# Altium schematic sheet Hrafn_Top.SchDoc: Hrafn
size Tabloid; DrawnBy: Nicholas Belsten; Organization: MIT; Address1: Route 40; Address2: Westford MA 01886; Address3: USA; DocumentNumber: 1; SheetNumber: 2; SheetTotal: 10; DCN: Aika; ProgramName: AERO-VISTA; Section: Top
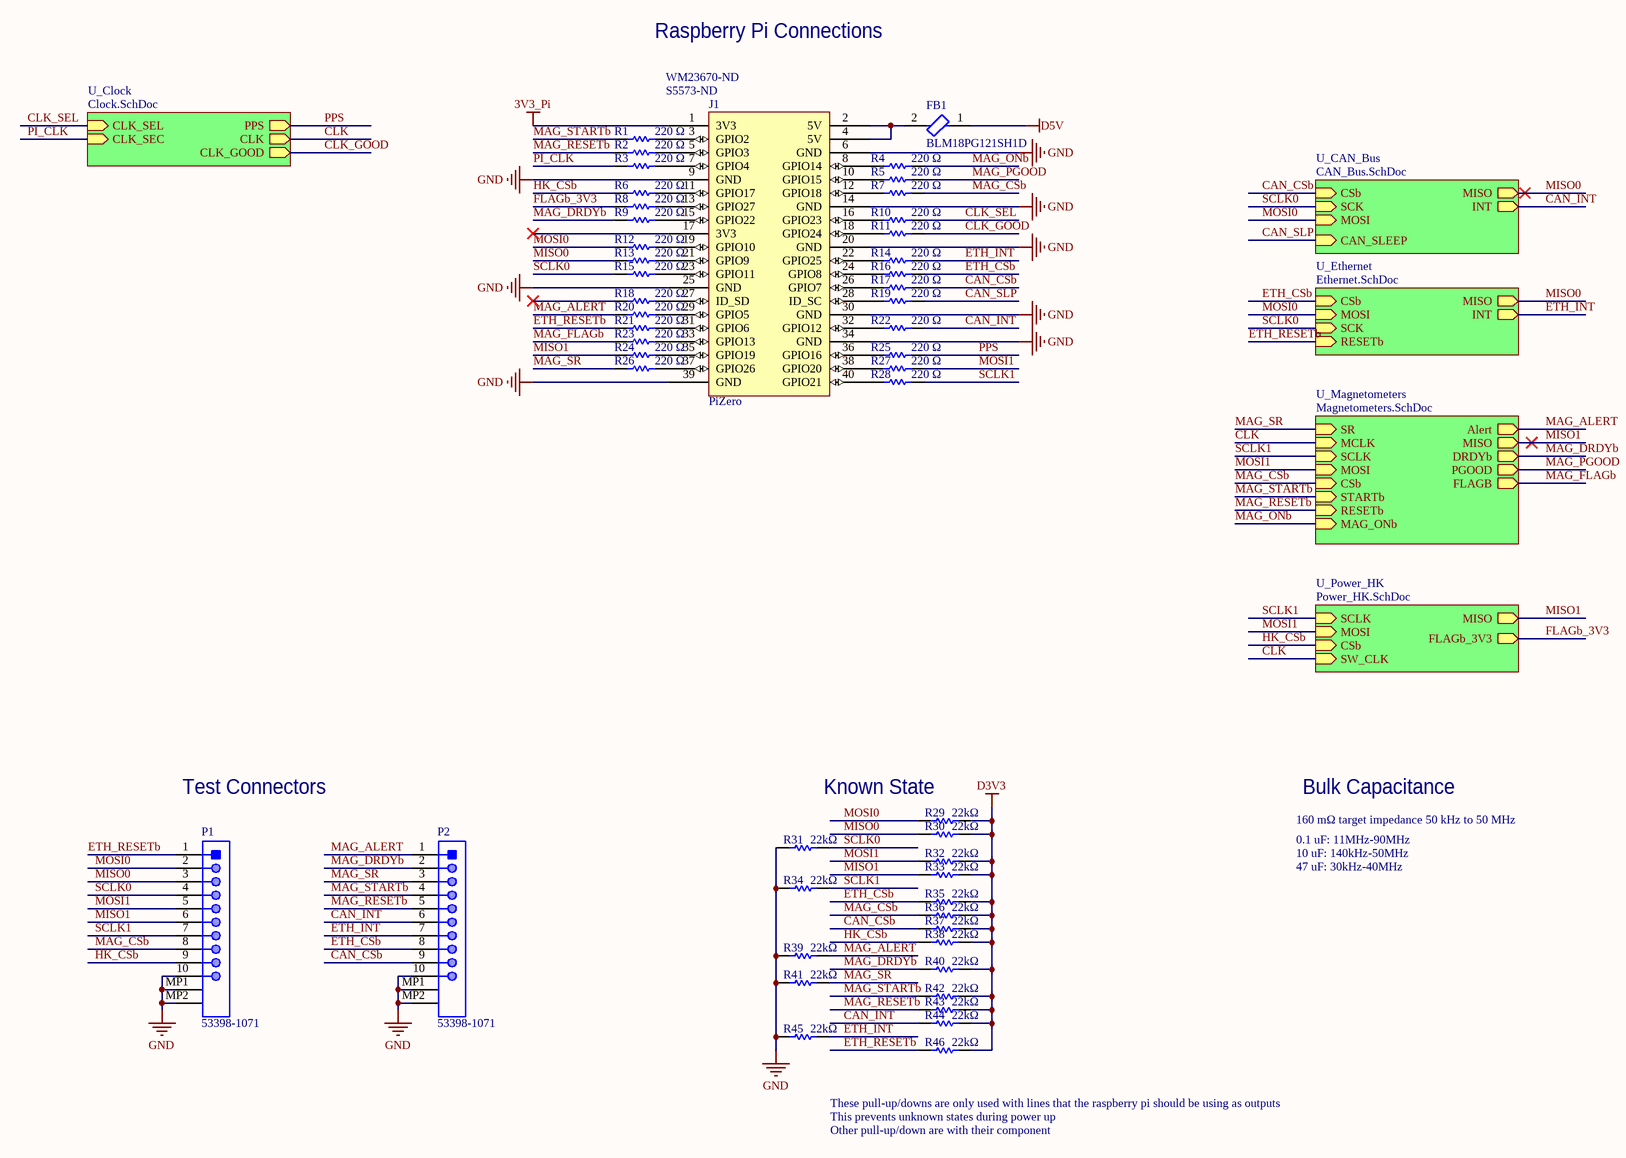
[diagram p0: Hrafn_Top.SchDoc]

## Parts
FB1  BLM18PG121SH1D  [FP-BLM18-0_15-t0_8-IPC_C]
J1  PiZero  Supplier Part Number 1: S5573-ND  Supplier Part Number 2: WM23670-ND  [DIP40]
P1  53398-1071  [MOLX-53398-1071_V]
P2  53398-1071  [MOLX-53398-1071_V]
R1  220 Ω  [RESC1005X40X25LL05T05]
R2  220 Ω  [RESC1005X40X25LL05T05]
R3  220 Ω  [RESC1005X40X25LL05T05]
R4  220 Ω  [RESC1005X40X25LL05T05]
R5  220 Ω  [RESC1005X40X25LL05T05]
R6  220 Ω  [RESC1005X40X25LL05T05]
R7  220 Ω  [RESC1005X40X25LL05T05]
R8  220 Ω  [RESC1005X40X25LL05T05]
R9  220 Ω  [RESC1005X40X25LL05T05]
R10  220 Ω  [RESC1005X40X25LL05T05]
R11  220 Ω  [RESC1005X40X25LL05T05]
R12  220 Ω  [RESC1005X40X25LL05T05]
R13  220 Ω  [RESC1005X40X25LL05T05]
R14  220 Ω  [RESC1005X40X25LL05T05]
R15  220 Ω  [RESC1005X40X25LL05T05]
R16  220 Ω  [RESC1005X40X25LL05T05]
R17  220 Ω  [RESC1005X40X25LL05T05]
R18  220 Ω  [RESC1005X40X25LL05T05]
R19  220 Ω  [RESC1005X40X25LL05T05]
R20  220 Ω  [RESC1005X40X25LL05T05]
R21  220 Ω  [RESC1005X40X25LL05T05]
R22  220 Ω  [RESC1005X40X25LL05T05]
R23  220 Ω  [RESC1005X40X25LL05T05]
R24  220 Ω  [RESC1005X40X25LL05T05]
R25  220 Ω  [RESC1005X40X25LL05T05]
R26  220 Ω  [RESC1005X40X25LL05T05]
R27  220 Ω  [RESC1005X40X25LL05T05]
R28  220 Ω  [RESC1005X40X25LL05T05]
R29  22kΩ  [RESC1005X40X25LL05T05]
R30  22kΩ  [RESC1005X40X25LL05T05]
R31  22kΩ  [RESC1005X40X25LL05T05]
R32  22kΩ  [RESC1005X40X25LL05T05]
R33  22kΩ  [RESC1005X40X25LL05T05]
R34  22kΩ  [RESC1005X40X25LL05T05]
R35  22kΩ  [RESC1005X40X25LL05T05]
R36  22kΩ  [RESC1005X40X25LL05T05]
R37  22kΩ  [RESC1005X40X25LL05T05]
R38  22kΩ  [RESC1005X40X25LL05T05]
R39  22kΩ  [RESC1005X40X25LL05T05]
R40  22kΩ  [RESC1005X40X25LL05T05]
R41  22kΩ  [RESC1005X40X25LL05T05]
R42  22kΩ  [RESC1005X40X25LL05T05]
R43  22kΩ  [RESC1005X40X25LL05T05]
R44  22kΩ  [RESC1005X40X25LL05T05]
R45  22kΩ  [RESC1005X40X25LL05T05]
R46  22kΩ  [RESC1005X40X25LL05T05]

## Sub-sheets
U_CAN_Bus = CAN_Bus.SchDoc: CSb (in), SCK (in), MOSI (in), MISO (out), INT (out), CAN_SLEEP (in)
U_Clock = Clock.SchDoc: PPS (out), CLK_SEL (in), CLK (out), CLK_SEC (in), CLK_GOOD (out)
U_Ethernet = Ethernet.SchDoc: CSb (in), MOSI (in), MISO (out), SCK (in), INT (out), RESETb (in)
U_Magnetometers = Magnetometers.SchDoc: SR (in), MCLK (in), Alert (out), SCLK (in), MOSI (in), MISO (out), CSb (in), DRDYb (out), STARTb (in), RESETb (in), MAG_ONb (in), PGOOD (out), FLAGB (out)
U_Power_HK = Power_HK.SchDoc: SCLK (in), MOSI (in), MISO (out), CSb (in), SW_CLK (in), FLAGb_3V3 (out)

## Nets
3V3_Pi: J1.1(3V3)
D3V3: R29.2 R30.2 R32.2 R33.2 R35.2 R36.2 R37.2 R38.2 R40.2 R42.2 R43.2 R44.2 R46.2
D5V: FB1.1
GND: J1.6(GND) J1.9(GND) J1.14(GND) J1.20(GND) J1.25(GND) J1.30(GND) J1.34(GND) J1.39(GND) P1.10 P1.MP1 P1.MP2 P2.10 P2.MP1 P2.MP2 R31.1 R34.1 R39.1 R41.1 R45.1
CAN_CSb: P2.9 R17.2 R37.1 ; sheet U_CAN_Bus/CSb
CAN_INT: P2.6 R22.2 R44.1 ; sheet U_CAN_Bus/INT
CAN_SLP: R19.2 ; sheet U_CAN_Bus/CAN_SLEEP
CLK: sheet U_Magnetometers/MCLK, sheet U_Power_HK/SW_CLK, sheet U_Clock/CLK
CLK_GOOD: R11.2 ; sheet U_Clock/CLK_GOOD
CLK_SEL: R10.2 ; sheet U_Clock/CLK_SEL
ETH_CSb: P2.8 R16.2 R35.1 ; sheet U_Ethernet/CSb
ETH_INT: P2.7 R14.2 R45.2 ; sheet U_Ethernet/INT
ETH_RESETb: P1.1 R21.1 R46.1 ; sheet U_Ethernet/RESETb
FLAGb_3V3: R8.1 ; sheet U_Power_HK/FLAGb_3V3
HK_CSb: P1.9 R6.1 R38.1 ; sheet U_Power_HK/CSb
MAG_ALERT: P2.1 R20.1 R39.2 ; sheet U_Magnetometers/Alert
MAG_CSb: P1.8 R7.2 R36.1 ; sheet U_Magnetometers/CSb
MAG_DRDYb: P2.2 R9.1 R40.1 ; sheet U_Magnetometers/DRDYb
MAG_FLAGb: R23.1 ; sheet U_Magnetometers/FLAGB
MAG_ONb: R4.2 ; sheet U_Magnetometers/MAG_ONb
MAG_PGOOD: R5.2 ; sheet U_Magnetometers/PGOOD
MAG_RESETb: P2.5 R2.1 R43.1 ; sheet U_Magnetometers/RESETb
MAG_SR: P2.3 R26.1 R41.2 ; sheet U_Magnetometers/SR
MAG_STARTb: P2.4 R1.1 R42.1 ; sheet U_Magnetometers/STARTb
MISO0: P1.3 R13.1 R30.1 ; sheet U_CAN_Bus/MISO, sheet U_Ethernet/MISO
MISO1: P1.6 R24.1 R33.1 ; sheet U_Magnetometers/MISO, sheet U_Power_HK/MISO
MOSI0: P1.2 R12.1 R29.1 ; sheet U_CAN_Bus/MOSI, sheet U_Ethernet/MOSI
MOSI1: P1.5 R27.2 R32.1 ; sheet U_Magnetometers/MOSI, sheet U_Power_HK/MOSI
PI_CLK: R3.1 ; sheet U_Clock/CLK_SEC
PPS: R25.2 ; sheet U_Clock/PPS
SCLK0: P1.4 R15.1 R31.2 ; sheet U_CAN_Bus/SCK, sheet U_Ethernet/SCK
SCLK1: P1.7 R28.2 R34.2 ; sheet U_Magnetometers/SCLK, sheet U_Power_HK/SCLK
NetFB1_2: FB1.2 J1.2(5V) J1.4(5V)
NetJ1_3: J1.3(GPIO2) R1.2
NetJ1_5: J1.5(GPIO3) R2.2
NetJ1_7: J1.7(GPIO4) R3.2
NetJ1_8: J1.8(GPIO14) R4.1
NetJ1_10: J1.10(GPIO15) R5.1
NetJ1_11: J1.11(GPIO17) R6.2
NetJ1_12: J1.12(GPIO18) R7.1
NetJ1_13: J1.13(GPIO27) R8.2
NetJ1_15: J1.15(GPIO22) R9.2
NetJ1_16: J1.16(GPIO23) R10.1
NetJ1_18: J1.18(GPIO24) R11.1
NetJ1_19: J1.19(GPIO10) R12.2
NetJ1_21: J1.21(GPIO9) R13.2
NetJ1_22: J1.22(GPIO25) R14.1
NetJ1_23: J1.23(GPIO11) R15.2
NetJ1_24: J1.24(GPIO8) R16.1
NetJ1_26: J1.26(GPIO7) R17.1
NetJ1_27: J1.27(ID_SD) R18.2
NetJ1_28: J1.28(ID_SC) R19.1
NetJ1_29: J1.29(GPIO5) R20.2
NetJ1_31: J1.31(GPIO6) R21.2
NetJ1_32: J1.32(GPIO12) R22.1
NetJ1_33: J1.33(GPIO13) R23.2
NetJ1_35: J1.35(GPIO19) R24.2
NetJ1_36: J1.36(GPIO16) R25.1
NetJ1_37: J1.37(GPIO26) R26.2
NetJ1_38: J1.38(GPIO20) R27.1
NetJ1_40: J1.40(GPIO21) R28.1

Not connected (* = marked no-connect by the designer): J1 17(3V3)*; R18 1*

## Notes on the sheet
- Raspberry Pi Connections
- Test Connectors
- Known State
- 160 mΩ target impedance 50 kHz to 50 MHz
- Bulk Capacitance
- 0.1 uF: 11MHz-90MHz
- 10 uF: 140kHz-50MHz
- 47 uF: 30kHz-40MHz
- These pull-up/downs are only used with lines that the raspberry pi should be using as outputs
- This prevents unknown states during power up
- Other pull-up/down are with their component
- Title
- Size
- Date
- Tabloid
- Section
- Time
- Sheet
- of
- Revision
- Drawn
- 33-207 / 77 Mass. Ave.
- Cambridge, MA 02139
- File

## Library data of the parts
FB1 = CMP-06046-000335-1: Chip Ferrite Bead, 0603, 120Ω @ 100MHz, 0.05Ω, 25%, 2A; Impedance: 120R; Shielding: Unshielded; Number of Lines: 1; DC Resistance (DCR): 50mR; Case/Package: 0603; Max Current Rating: 2A; Ratings: AEC-Q200; Case Code (Metric): 1608; Height: 0.8mm; Max DC Current: 2A; Contact Plating: Tin; Max Operating Temperature: 125°C; Width: 0.031inch; Number of Circuits: 1; Min Operating Temperature: -55°C; Mount: Surface Mount; Test Frequency: 100MHz; Tolerance: 25%; Packaging: Tape and Reel; Length: 1.6mm; Weight: 7.1E-05oz; Package Quantity: 4000; Case Code (Imperial): 0603; Termination: SMD/SMT; Material: Ferrite; Depth: 0.8mm; Lead Free: Lead Free; Current Rating: 2A
P1 P2 = CMP-2000-05635-1: Male Header, Pitch 1.25 mm, 1 x 10 Position, Height 4.7 mm, -40 to 85 degC, RoHS, Tape and Reel; Manufacturer: Molex; Mounting Angle: Vertical; Pitch: 1.25mm; Voltage Rating: 125V; Current Rating: 1A; Number of Rows: 1Row; Housing Material: Nylon; Mounting Technology: SurfaceMount; Mounting Style: SMD; Contact Material: PhosphorBronze; Product: Headers; Datasheet URL: http://www.molex.com/pdm_docs/sd/533981071_sd.pdf; Manufacturer URL: http://www.molex.com/; Datasheet Version: Rev. J, 09/2015; Factory Pack Quantity: 1000; Brand: Molex; Packaging: Reel; Product Category: Headers&WireHousings; Contact Gender: Pin(Male); Number of Positions: 10Position; RoHS: Details; Contact Plating: Tin; Package Description: Male Header, Pitch 1.25 mm, 1 x 10 Position, Height 4.7 mm; Series: 53398; Type: Shrouded; Package Reference: 53398-1071; Tradename: PicoBlade; Termination Style: SMD
R1-R28 = CMP-2002-08356-1: Part Number: CRCW040220K0FKED; Manufacturer: Vishay Dale; Resistance: 220 Ω
R29-R46 = CMP-2002-00489-1: Manufacturer: Panasonic; Part Number: ERJ-2GEJ223X; Resistance: 22kΩ
J1 = PiZero: Supplier 1: Digi-Key; Supplier 2: Digi-Key